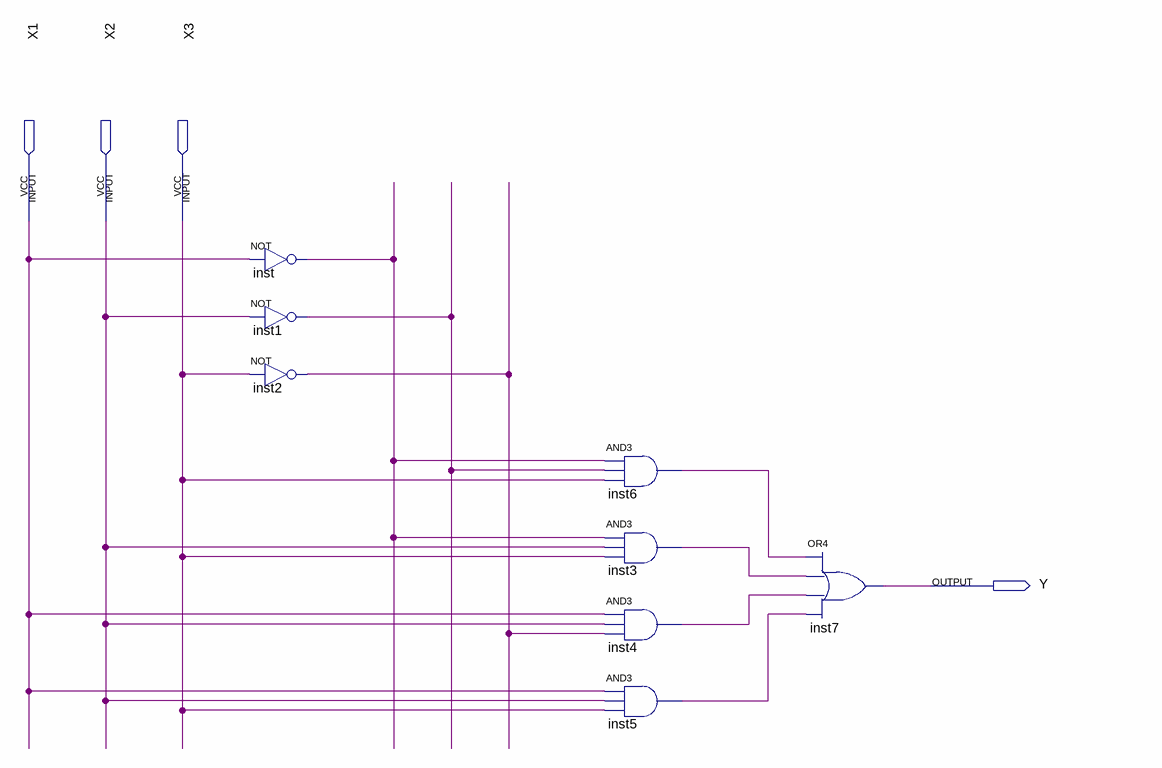
[diagram p0: schematic sheet]
// Quartus schematic lab2_1.bdf as structural Verilog: 8 symbols, 4 pins
module lab2_1 (
  input  X1,
  input  X2,
  input  X3,
  output Y
);

  wire inst1_out, inst2_out, inst3_out, inst4_out, inst5_out, inst6_out, inst_out;

  not inst (inst_out, X1);
  not inst1 (inst1_out, X2);
  not inst2 (inst2_out, X3);
  and inst6 (inst6_out, inst_out, inst1_out, X3);
  and inst3 (inst3_out, inst_out, X2, X3);
  and inst4 (inst4_out, X1, X2, inst2_out);
  and inst5 (inst5_out, X1, X2, X3);
  or inst7 (Y, inst6_out, inst3_out, inst4_out, inst5_out);
endmodule
